# Altium schematic sheet current_measurment.SchDoc
size Letter
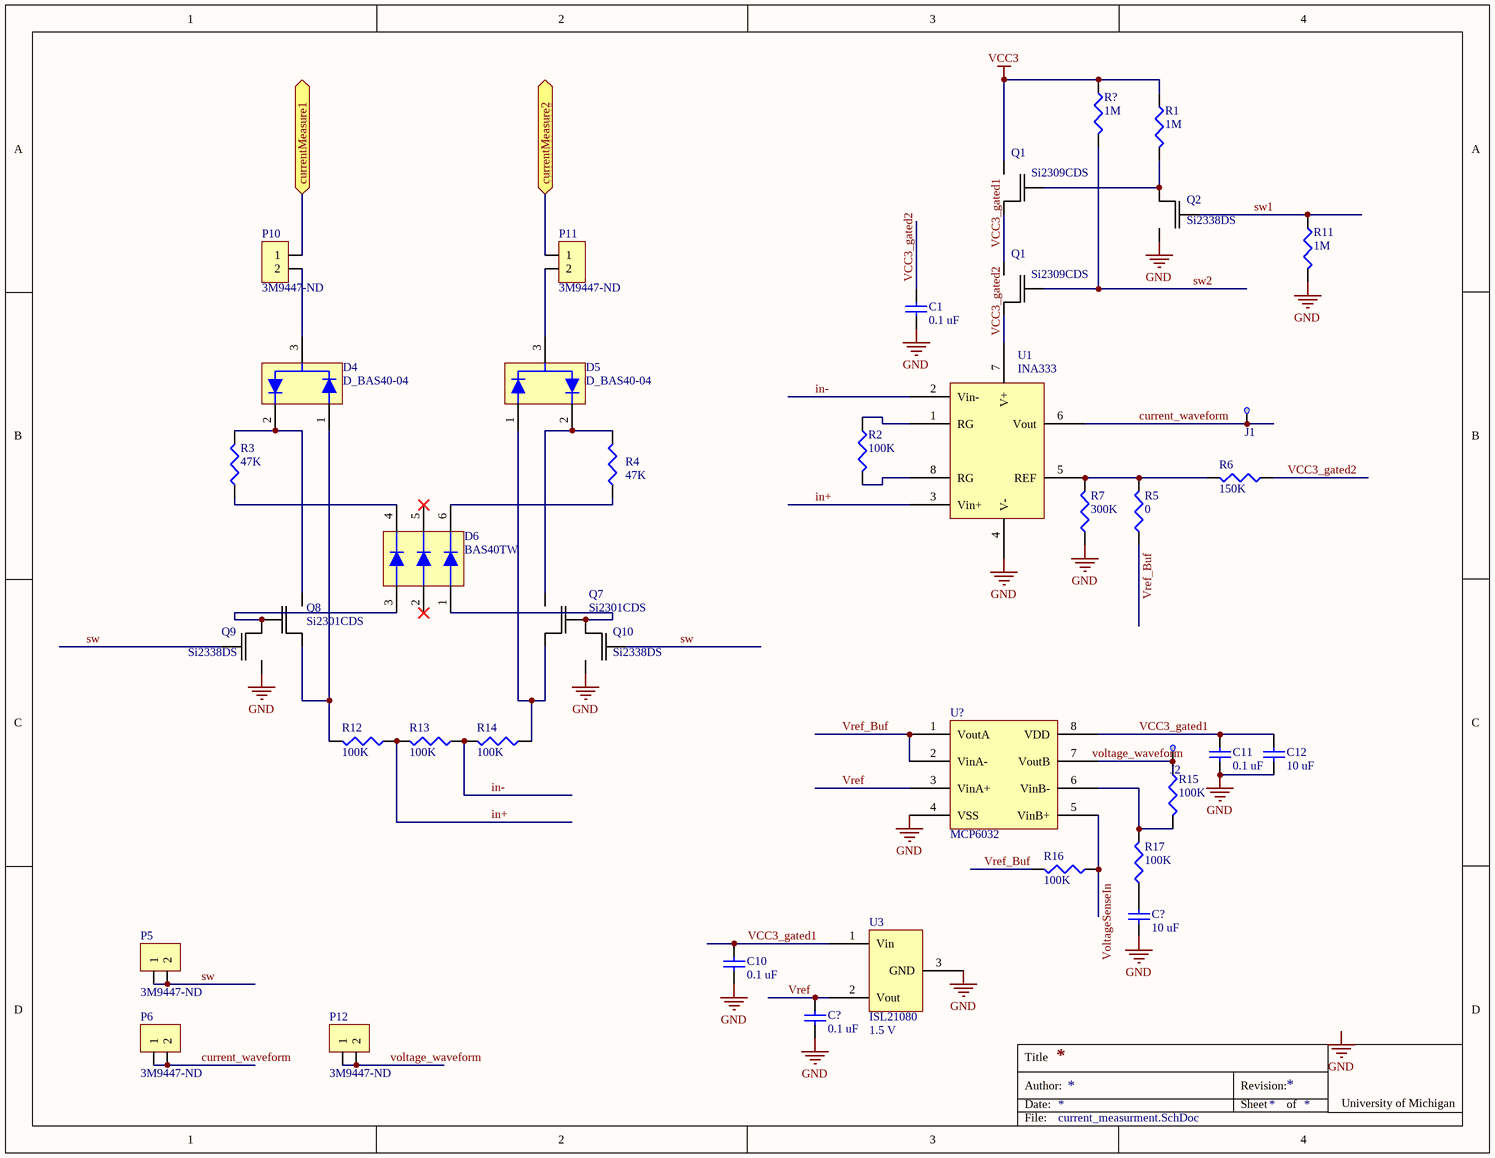
[diagram p0: current_measurment.SchDoc]

## Parts
(Parts that share a designator on the sheet are numbered #1, #2 ... from top to bottom, then left to right.)
C1  value 0.1 uF  [0603]  (hidden comment: Ceramic capacitor)
C10  value 0.1 uF  [0603]  (hidden comment: Ceramic capacitor)
C11  value 0.1 uF  [0603]  (hidden comment: Ceramic capacitor)
C12  value 10 uF  [0603]  (hidden comment: Ceramic capacitor)
C?#1  value 10 uF  [0603]  (hidden comment: Ceramic capacitor)
C?#2  value 0.1 uF  [0603]  (hidden comment: Ceramic capacitor)
D4  D_BAS40-04  [SOT23-3]
D5  D_BAS40-04  [SOT23-3]
D6  BAS40TW  [SOT-363]
J1  5004  [TestPoint]  (value not drawn)
J2  5004  [TestPoint]  (value not drawn)
P5  Supplier Part Number 1: 3M9447-ND  [1x2 header]  (hidden comment: 1 x 2 header)
P6  Supplier Part Number 1: 3M9447-ND  [1x2 header]  (hidden comment: 1 x 2 header)
P10  Supplier Part Number 1: 3M9447-ND  [1x2 header]  (hidden comment: 1 x 2 header)
P11  Supplier Part Number 1: 3M9447-ND  [1x2 header]  (hidden comment: 1 x 2 header)
P12  Supplier Part Number 1: 3M9447-ND  [1x2 header]  (hidden comment: 1 x 2 header)
Q1#1  Si2309CDS  [SOT23-3]
Q1#2  Si2309CDS  [SOT23-3]
Q2  Si2338DS  [SOT23-3]
Q7  Si2301CDS  [SOT23-3]
Q8  Si2301CDS  [SOT23-3]
Q9  Si2338DS  [SOT23-3]
Q10  Si2338DS  [SOT23-3]
R1  value 1M  [0603]  (hidden comment: Chip resistor)
R2  value 100K  [0603]  (hidden comment: Chip resistor)
R3  value 47K  [0603]  (hidden comment: Chip resistor)
R4  value 47K  [0603]  (hidden comment: Chip resistor)
R5  value 0  [0603]  (hidden comment: Chip resistor)
R6  value 150K  [0603]  (hidden comment: Chip resistor)
R7  value 300K  [0603]  (hidden comment: Chip resistor)
R11  value 1M  [0603]  (hidden comment: Chip resistor)
R12  value 100K  [0603]  (hidden comment: Chip resistor)
R13  value 100K  [0603]  (hidden comment: Chip resistor)
R14  value 100K  [0603]  (hidden comment: Chip resistor)
R15  value 100K  [0603]  (hidden comment: Chip resistor)
R16  value 100K  [0603]  (hidden comment: Chip resistor)
R17  value 100K  [0603]  (hidden comment: Chip resistor)
R?  value 1M  [0603]  (hidden comment: Chip resistor)
U1  INA333  [MSOP-8]
U3  ISL21080  Output Voltage: 1.5 V  [SOT23-3]
U?  MCP6032  [MSOP-8]

## Ports
currentMeasure1, currentMeasure2

## Nets
GND: C1.2 C10.2 C11.2 C12.2 C?#1.2 C?#2.2 Q2.2(S) Q9.2(S) Q10.2(S) R7.2 R11.1 U1.4(V-) U3.3(GND) U?.4(VSS)
VCC3: Q1#1.2(S) R1.2 R?.2
current_waveform: J1.1(TB) P6.1 P6.2 U1.6(Vout)
currentMeasure1: P10.1 ; port currentMeasure1
currentMeasure2: P11.1 ; port currentMeasure2
in+: R12.2 R13.1 U1.3(Vin+)
in-: R13.2 R14.1 U1.2(Vin-)
sw: P5.1 P5.2 Q9.1(G) Q10.1(G)
sw1: Q2.1(G) R11.2
sw2: Q1#2.1(G) R?.1
VCC3_gated1: C10.1 C11.1 C12.1 Q1#1.3(D) Q1#2.2(S) U3.1(Vin) U?.8(VDD)
VCC3_gated2: C1.1 Q1#2.3(D) R6.2 U1.7(V+)
voltage_waveform: P12.1 P12.2
VoltageSenseIn: R16.2 U?.5(VinB+)
Vref: C?#2.1 U3.2(Vout) U?.3(VinA+)
Vref_Buf: R5.2 R16.1 U?.1(VoutA) U?.2(VinA-)
NetC?#1_1: C?#1.1 R17.2
NetD4_1: D4.1 Q8.3(D) R12.1
NetD4_2: D4.2 Q8.2(S) R3.1
NetD4_3: D4.3 P10.2
NetD5_1: D5.1 Q7.3(D) R14.2
NetD5_2: D5.2 Q7.2(S) R4.1
NetD5_3: D5.3 P11.2
NetD6_1: D6.1 Q7.1(G) Q10.3(D)
NetD6_3: D6.3 Q8.1(G) Q9.3(D)
NetD6_4: D6.4 R3.2
NetD6_6: D6.6 R4.2
NetJ2_1: J2.1(TB) R15.2 U?.7(VoutB)
NetQ1#1_1: Q1#1.1(G) Q2.3(D) R1.1
NetR2_1: R2.1 U1.8(RG)
NetR2_2: R2.2 U1.1(RG)
NetR5_1: R5.1 R6.1 R7.1 U1.5(REF)
NetR15_1: R15.1 R17.1 U?.6(VinB-)

Not connected (* = marked no-connect by the designer): D6 2* 5*

## Notes on the sheet
- Labels drawn without touching a wire or pin: GND, voltage_waveform
- Title
- Date:
- Author:
- Revision:
- Sheet
- of
- University of Michigan
- File:

## Library data of the parts
C1 C10 C11 C?#2 = C_0.1u_25V_0603_ceramic: Ceramic capacitor, 0.1 uF, 0603 package; Manufacture: TDK; voltage rated: 25V; tolerance: 10%; package: 0603; Supplier 1: Digi-Key; Supplier Part Number 1: 445-1316-1-ND
C12 C?#1 = C_10u_6.3V_0603_ceramic: Ceramic capacitor, 10 uF, 0603 package; Manufacture: TDK; voltage rated: 6.3V; tolerance: 20%; package: 0603; Supplier 1: Digi-Key; Supplier Part Number 1: 445-4112-1-ND
D4 D5 = D_BAS40-04: SURFACE MOUNT SCHOTTKY BARRIER DIODE; Supplier 1: Digi-Key; Supplier Part Number 1: BAS40-04FDICT-ND
D6 = D_BAS40TW: SURFACE MOUNT SCHOTTKY BARRIER DIODE ARRAYS; Supplier 1: Digi-Key; Supplier Part Number 1: BAS40TWDICT-ND
J1 J2 = TestPoint: TEST POINT PC MINI .040"D YELLOW; Supplier 1: Digi-Key; Supplier Part Number 1: 5004K-ND; datasheet: http://mail.keyelco.com/ENG._DEPT/PDF%20CAT%20NO%20Drawings/5004.pdf
P5 P6 P10-P12 = 1 x 2 header: 100 mils standard header; Supplier 1: Digi-Key
Q1#1 Q1#2 = Si2309CDS: P-Channel 60-V (D-S) MOSFET; Supplier 1: Digi-Key; Supplier Part Number 1: SI2309CDS-T1-E3CT-ND
Q2 Q9 Q10 = Si2338DS: N-Channel 30 V (D-S) MOSFET; Supplier 1: Digi-Key; Supplier Part Number 1: SI2338DS-T1-GE3CT-ND
Q7 Q8 = Si2301CDS: P-Channel 20 V (D-S) MOSFET; Supplier 1: Digi-Key; Supplier Part Number 1: SI2301CDS-T1-E3CT-ND
R1 R11 R? = R_1M_0603: Chip resistor, 1 Meg, 0603 package; tolerance: 1%; power: 1/10 W; package: 0603; Supplier 1: Digi-Key; Supplier Part Number 1: 541-1.00MHCT-ND
R2 R12-R17 = R_100K_0603: Chip resistor, 100K, 0603 package; tolerance: 1%; power: 1/10 W; package: 0603; Supplier 1: Digi-Key; Supplier Part Number 1: 541-100KHCT-ND
R3 R4 = R_47K_0603: Chip resistor, 47K, 0603 package; tolerance: 1%; power: 1/10 W; package: 0603; Supplier 1: Digi-Key; Supplier Part Number 1: 541-47.0KHCT-ND
R5 = R_0_0603: Chip resistor, 0, 0603 package; package: 0603; Supplier 1: Digi-Key; Supplier Part Number 1: 541-0.0GCT-ND
R6 = R_150K_0603: Chip resistor, 150K, 0603 package; tolerance: 1%; power: 1/10 W; package: 0603; Supplier 1: Digi-Key; Supplier Part Number 1: 541-150KHCT-ND
R7 = R_300K_0603: Chip resistor, 300K, 0603 package; tolerance: 1%; power: 1/10 W; package: 0603; Supplier 1: Digi-Key; Supplier Part Number 1: 541-300KHCT-ND
U1 = INA333: Micro-Power (50µA), Zerø-Drift, Rail-to-Rail Out  Instrumentation Amplifier; Supplier 1: Digi-Key; Supplier Part Number 1: 296-23564-1-ND
U3 = ISL21080: 300nA NanoPower Voltage References; Supplier 1: Digi-Key; Supplier Part Number 1: ISL21080CIH315Z-T7ACT-ND
U? = MCP6032: 0.9 µA, High Precision Op Amps; Supplier 1: Digi-Key; Supplier Part Number 1: MCP6032T-E/MSCT-ND